# EAGLE design 549-addon (EAGLE 7.2.0)
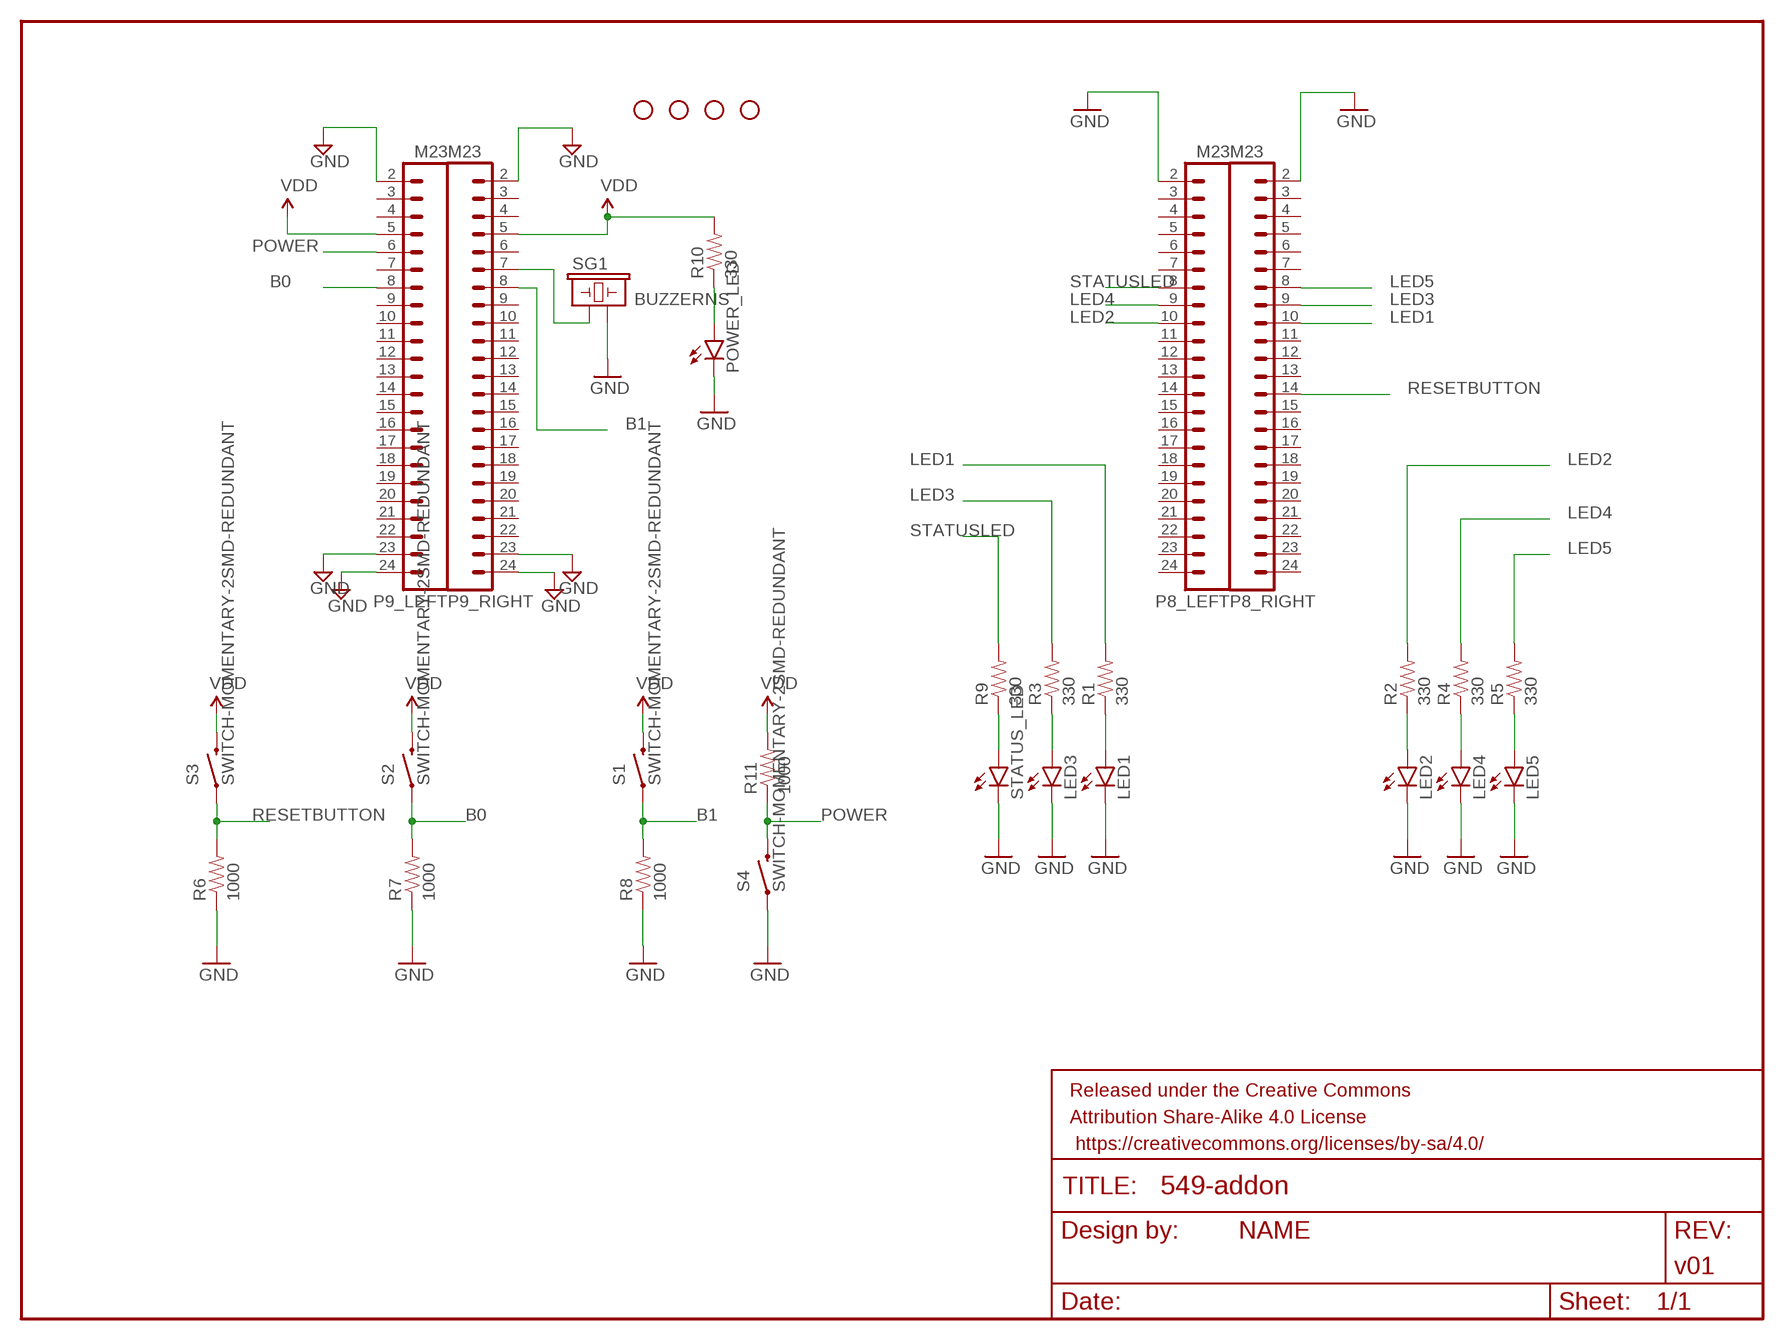
[diagram p0: schematic, sheet 1]

## Parts
FRAME1  FRAME-LETTER  [CREATIVE_COMMONS]
LED1  LED1206  [LED-1206]
LED2  LED1206  [LED-1206]
LED3  LED1206  [LED-1206]
LED4  LED1206  [LED-1206]
LED5  LED1206  [LED-1206]
P8_LEFT  M23  [1X23]
P8_RIGHT  M23  [1X23]
P9_LEFT  M23  [1X23]
P9_RIGHT  M23  [1X23]
POWER_LED  LED1206  [LED-1206]
R1  330  RESISTOR1206  [1206]
R2  330  RESISTOR1206  [1206]
R3  330  RESISTOR1206  [1206]
R4  330  RESISTOR1206  [1206]
R5  330  RESISTOR1206  [1206]
R6  1000  RESISTOR1206  [1206]
R7  1000  RESISTOR1206  [1206]
R8  1000  RESISTOR1206  [1206]
R9  330  RESISTOR1206  [1206]
R10  330  RESISTOR1206  [1206]
R11  1000  RESISTOR1206  [1206]
S1  SWITCH-MOMENTARY-2SMD-REDUNDANT  [TACTILE-SWITCH-SMD]
S2  SWITCH-MOMENTARY-2SMD-REDUNDANT  [TACTILE-SWITCH-SMD]
S3  SWITCH-MOMENTARY-2SMD-REDUNDANT  [TACTILE-SWITCH-SMD]
S4  SWITCH-MOMENTARY-2SMD-REDUNDANT  [TACTILE-SWITCH-SMD]
SG1  BUZZERNS  [BUZZER-12MM-NS]
STANDOFF1  STAND-OFF  [STAND-OFF]
STANDOFF2  STAND-OFF  [STAND-OFF]
STANDOFF3  STAND-OFF  [STAND-OFF]
STANDOFF4  STAND-OFF  [STAND-OFF]
STATUS_LED  LED1206  [LED-1206]

## Nets
B0: P9_LEFT.8 R7.2 S2.1 S2.2
B1: P9_RIGHT.8 R8.2 S1.1 S1.2
GND: LED1.C LED2.C LED3.C LED4.C LED5.C P8_LEFT.2 P8_RIGHT.2 P9_LEFT.2 P9_LEFT.23 P9_LEFT.24 P9_RIGHT.2 P9_RIGHT.23 P9_RIGHT.24 POWER_LED.C R6.1 R7.1 R8.1 S4.1 S4.2 SG1.- STATUS_LED.C
LED1: P8_RIGHT.10 R1.2
LED2: P8_LEFT.10 R2.2
LED3: P8_RIGHT.9 R3.2
LED4: P8_LEFT.9 R4.2
LED5: P8_RIGHT.8 R5.2
N$1: LED1.A R1.1
N$2: LED2.A R2.1
N$3: LED3.A R3.1
N$4: LED4.A R4.1
N$11: LED5.A R5.1
N$12: R9.1 STATUS_LED.A
N$13: POWER_LED.A R10.1
N$14: P9_RIGHT.7 SG1.+
POWER: P9_LEFT.6 R11.1 S4.3 S4.4
RESETBUTTON: P8_RIGHT.14 R6.2 S3.1 S3.2
STATUSLED: P8_LEFT.8 R9.2
VDD: P9_LEFT.5 P9_RIGHT.5 R10.2 R11.2 S1.3 S1.4 S2.3 S2.4 S3.3 S3.4
Unconnected: P8_LEFT.3 P8_LEFT.4 P8_LEFT.5 P8_LEFT.6 P8_LEFT.7 P8_LEFT.11 P8_LEFT.12 P8_LEFT.13 P8_LEFT.14 P8_LEFT.15 P8_LEFT.16 P8_LEFT.17 P8_LEFT.18 P8_LEFT.19 P8_LEFT.20 P8_LEFT.21 P8_LEFT.22 P8_LEFT.23 P8_LEFT.24 P8_RIGHT.3 P8_RIGHT.4 P8_RIGHT.5 P8_RIGHT.6 P8_RIGHT.7 P8_RIGHT.11 P8_RIGHT.12 P8_RIGHT.13 P8_RIGHT.15 P8_RIGHT.16 P8_RIGHT.17 P8_RIGHT.18 P8_RIGHT.19 P8_RIGHT.20 P8_RIGHT.21 P8_RIGHT.22 P8_RIGHT.23 P8_RIGHT.24 P9_LEFT.3 P9_LEFT.4 P9_LEFT.7 P9_LEFT.9 P9_LEFT.10 P9_LEFT.11 P9_LEFT.12 P9_LEFT.13 P9_LEFT.14 P9_LEFT.15 P9_LEFT.16 P9_LEFT.17 P9_LEFT.18 P9_LEFT.19 P9_LEFT.20 P9_LEFT.21 P9_LEFT.22 P9_RIGHT.3 P9_RIGHT.4 P9_RIGHT.6 P9_RIGHT.9 P9_RIGHT.10 P9_RIGHT.11 P9_RIGHT.12 P9_RIGHT.13 P9_RIGHT.14 P9_RIGHT.15 P9_RIGHT.16 P9_RIGHT.17 P9_RIGHT.18 P9_RIGHT.19 P9_RIGHT.20 P9_RIGHT.21 P9_RIGHT.22

## Library data of the parts
FRAME1 = SparkFun-Aesthetics:FRAME-LETTER: Schematic Frame Standard 8.5x11 US Letter frame; DESIGNER: NAME; VERSION: v01
LED1-LED5 POWER_LED STATUS_LED = SparkFun-LED:LED: LEDs Standard schematic elements and footprints for 5mm, 3mm, 1206, and 0603 sized LEDs. 5mm - Spark Fun Electronics SKU : COM-00529 (and others)
P8_LEFT P8_RIGHT P9_LEFT P9_RIGHT = SparkFun-Connectors:M23
R1-R11 = SparkFun-Resistors:RESISTOR: Resistor Basic schematic elements and footprints for 0603, 1206, and PTH resistors.
S1-S4 = SparkFun-Electromechanical:SWITCH-MOMENTARY-2: Various NO switches- pushbuttons, reed, etc; PROD_ID: SWCH-08247
SG1 = SparkFun-Electromechanical:BUZZER: Buzzer 12mm Spark Fun Electronics SKU : Comp-Buzzer
STANDOFF1-STANDOFF4 = SparkFun-Electromechanical:STAND-OFF: #4 Stand Off This is the mechanical footprint for a #4 phillips button head screw. Use the keepout ring to avoid running the screw head into surrounding components. SKU : PRT-00447

## Board
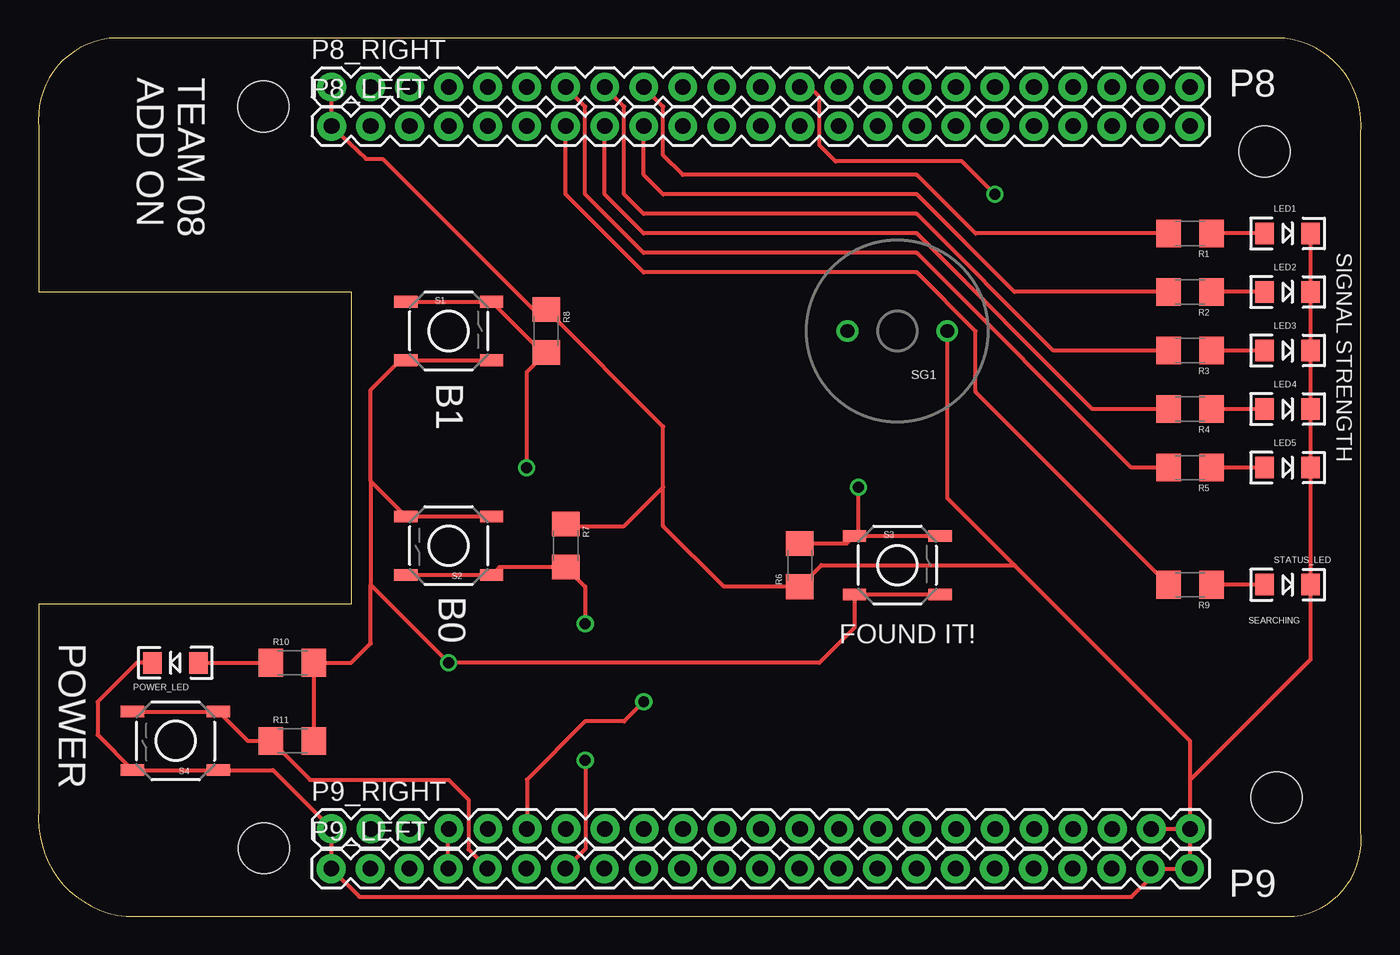
[diagram p1: board, top side]
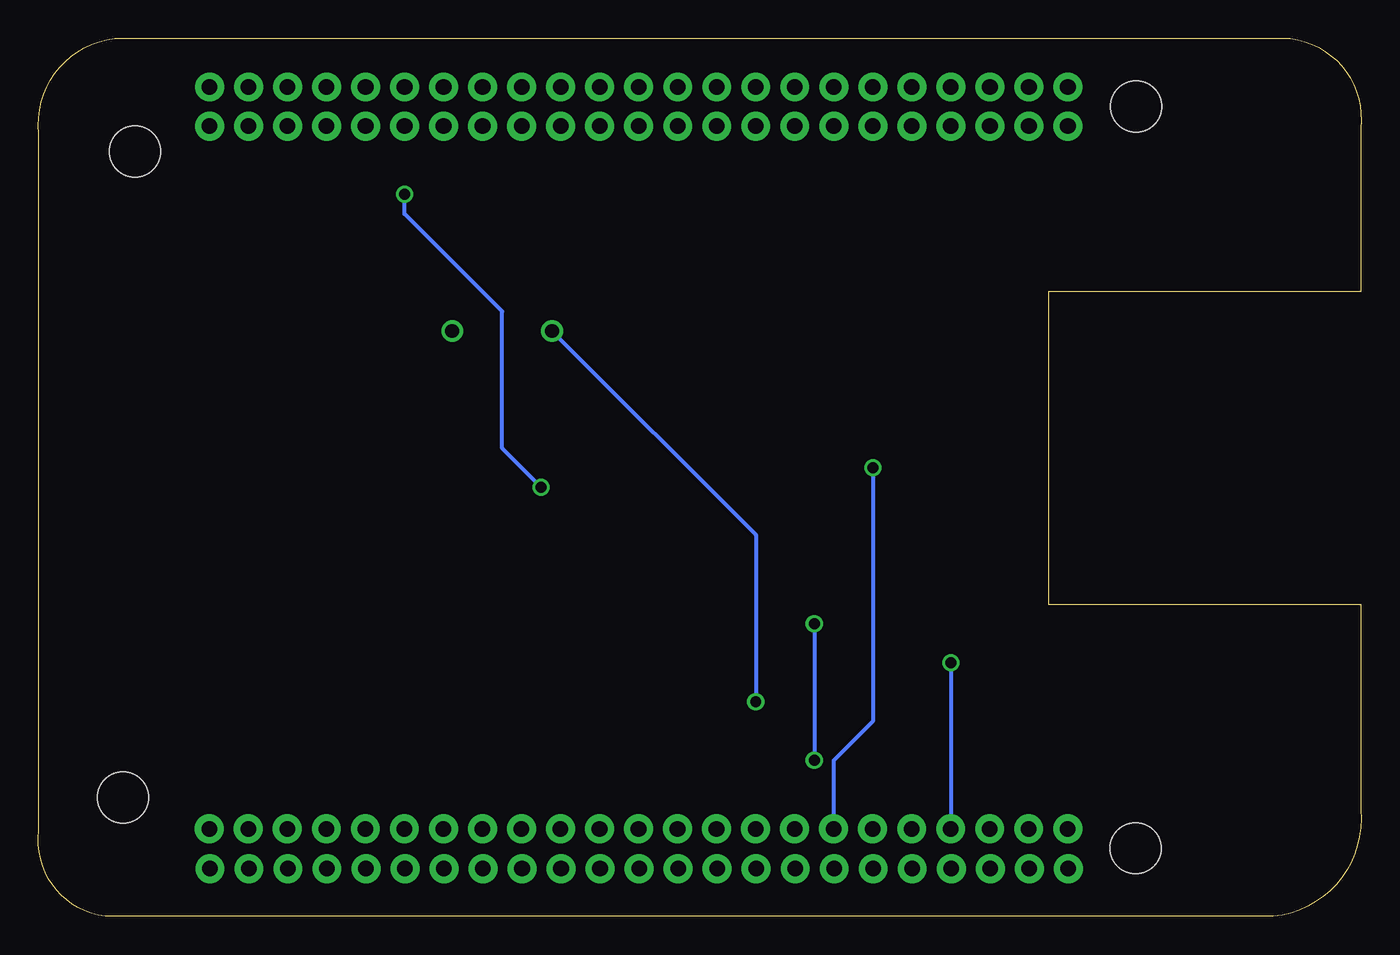
[diagram p2: board, bottom side, seen from below]

Size 86.1 x 57.14 mm. Coordinates in mm from the lower left corner, seen from the top.
Outline: 0.04,20.32 0.04,6.95 arc90 5.72,0 81.76,0 arc90 86.07,5.58 86.07,50.96 arc90 81.15,57.14 4.61,57.14 arc90 0.04,51.3 0.04,40.64 20.36,40.64 20.36,20.32 0.04,20.32
Copper layers (1*16): Top 0.035mm / dielectric 1.5mm / Bottom 0.035mm
Design rules "default": minimum track width 10mil, minimum drill 24mil, track to track 8mil, track to pad 8mil, pad to pad 8mil, via to via 8mil, smd to smd 8mil, copper to edge 40mil, drill to drill 8mil, minimum pad ring 10mil, minimum via ring 8mil, stop-mask expansion 4mil, vias tented up to drill 0mil, thermal gap 10mil

### Footprints (pad centres in the part's own frame; a part is rotated, then mirrored left to right if it is on the bottom)
LED-1206 = smd 1.2 x 1.4: A -1.5,0; C 1.5,0
1X23 = drill 1.016 pad 1.88: 2 -26.67,0; 3 -24.13,0; 4 -21.59,0; 5 -19.05,0; 6 -16.51,0; 7 -13.97,0; 8 -11.43,0; 9 -8.89,0; 10 -6.35,0; 11 -3.81,0; 12 -1.27,0; 13 1.27,0; 14 3.81,0; 15 6.35,0; 16 8.89,0; 17 11.43,0; 18 13.97,0; 19 16.51,0; 20 19.05,0; 21 21.59,0; 22 24.13,0; 23 26.67,0; 24 29.21,0
1206 = smd 1.6 x 1.8: 1 -1.4,0; 2 1.4,0
TACTILE-SWITCH-SMD = smd 1.524 x 0.762: 1 -2.794,1.905; 2 2.794,1.905; 3 -2.794,-1.905; 4 2.794,-1.905
BUZZER-12MM-NS = drill 0.9: + 3.25,0; - -3.25,0
STAND-OFF = hole 3.302: 0,0

### Placement (x,y rotation side)
FRAME1  -77.43,15.24 0 top  (outside the outline)
LED1  81.32,44.45 0 top
LED2  81.32,40.64 0 top
LED3  81.32,36.83 0 top
LED4  81.32,33.02 0 top
LED5  81.32,29.21 0 top
P8_LEFT  45.76,51.44 0 top
P8_RIGHT  45.76,53.98 0 top
P9_LEFT  45.73,3.11 0 top
P9_RIGHT  45.77,5.7 0 top
POWER_LED  8.93,16.51 180 top
R1  74.97,44.45 180 top
R2  74.97,40.64 180 top
R3  74.97,36.83 180 top
R4  74.97,33.02 180 top
R5  74.97,29.21 180 top
R6  49.57,22.86 90 top
R7  34.33,24.13 270 top
R8  33.06,38.1 270 top
R9  74.97,21.59 180 top
R10  16.55,16.51 0 top
R11  16.55,11.43 0 top
S1  26.71,38.1 0 top
S2  26.71,24.13 180 top
S3  55.92,22.86 0 top
S4  8.93,11.43 180 top
SG1  55.92,38.1 180 top
STANDOFF1  14.68,4.45 90 top
STANDOFF2  14.64,52.72 0 top
STANDOFF3  80.61,7.73 0 top
STANDOFF4  79.82,49.78 0 top
STATUS_LED  81.32,21.59 0 top

### Tracks (layer width: path | path; a pad name or v marks a point on that pad's centre or on a via)
B0  (via drill 0.71)
  Top 0.254: S2.2 S2.1 30.01,22.73 R7.2 35.6,21.46 v35.6,19.05 | 34.31,3.11 P9_LEFT.8 34.33,3.11 35.61,4.39 35.61,10.15 v35.6,10.16
  Bottom 0.254: v35.6,19.05 v35.6,10.16
B1  (via drill 0.71)
  Top 0.254: S1.1 S1.2 32.81,36.7 R8.2 31.79,35.43 v31.79,29.21
  Bottom 0.254: v31.79,29.21 31.79,12.7 34.34,10.15 P9_RIGHT.8
GND
  Top 0.254: P9_RIGHT.23 P9_RIGHT.24 | P9_RIGHT.24 74.98,3.11 P9_LEFT.24 P9_LEFT.23 72.4,2.52 71.16,1.27 20.9,1.27 P9_LEFT.2 19.06,5.66 P9_RIGHT.2 15.28,9.53 S4.1 S4.2 3.85,11.81 3.85,13.97 6.39,16.51 POWER_LED.C | P9_RIGHT.24 74.98,8.89 | 74.98,8.89 74.97,8.89 74.97,11.43 63.54,22.86 | LED1.C LED2.C LED3.C LED4.C LED5.C STATUS_LED.C 82.82,16.73 74.98,8.89 | P8_RIGHT.2 P8_LEFT.2 21.32,49.3 22.4,49.3 32.2,39.5 R8.1 40.68,31.88 40.68,27.94 | R7.1 34.46,25.4 38.14,25.4 40.68,27.94 | 63.54,22.86 50.97,22.86 R6.1 44.62,21.46 40.68,25.4 40.68,27.94 | 63.54,22.86 59.17,27.23 SG1.-
LED1
  Top 0.254: R1.2 61,44.45 57.19,48.26 41.95,48.26 40.68,49.53 40.68,52.71 P8_RIGHT.10
LED2
  Top 0.254: R2.2 63.54,40.64 57.19,46.99 40.68,46.99 39.41,48.26 P8_LEFT.10
LED3
  Top 0.254: R3.2 66.08,36.83 57.19,45.72 39.41,45.72 38.14,46.99 38.14,52.71 P8_RIGHT.9
LED4
  Top 0.254: R4.2 68.62,33.02 57.19,44.45 39.41,44.45 36.87,46.99 P8_LEFT.9
LED5
  Top 0.254: R5.2 71.16,29.21 57.19,43.18 39.41,43.18 35.6,46.99 35.6,52.71 P8_RIGHT.8
N$1
  Top 0.254: LED1.A R1.1
N$2
  Top 0.254: LED2.A R2.1
N$3
  Top 0.254: LED3.A R3.1
N$4
  Top 0.254: LED4.A R4.1
N$11
  Top 0.254: LED5.A R5.1
N$12
  Top 0.254: STATUS_LED.A R9.1
N$13
  Top 0.254: POWER_LED.A R10.1
N$14  (via drill 0.71)
  Top 0.254: v39.41,13.97 38.14,12.7 35.6,12.7 31.8,8.9 P9_RIGHT.7
  Bottom 0.254: SG1.+ 39.41,24.84 v39.41,13.97
POWER
  Top 0.254: S4.4 S4.3 13.63,11.43 R11.1 17.69,8.89 26.71,8.89 27.99,7.61 27.99,4.37 29.22,3.14 P9_LEFT.6
RESETBUTTON  (via drill 0.71)
  Top 0.254: S3.1 S3.2 | S3.1 52.62,24.26 R6.2 | S3.1 53.38,25.02 v53.38,27.94 | v62.27,46.99 60.12,49.14 51.89,49.14 50.84,50.19 50.84,53.34 50.2,53.98 P8_RIGHT.14
  Bottom 0.254: v53.38,27.94 55.92,30.48 55.92,39.37 62.27,45.72 v62.27,46.99
STATUSLED
  Top 0.254: R9.2 61,34.16 61,38.1 57.19,41.91 39.41,41.91 34.33,46.99 P8_LEFT.8
VDD  (via drill 0.71)
  Top 0.254: S1.4 S1.3 23.53,36.2 21.63,34.29 21.63,28.32 | S2.3 S2.4 21.63,28.32 | S3.4 S3.3 53.12,18.8 50.84,16.51 v26.71,16.51 21.63,21.59 | P9_LEFT.5 26.68,5.66 P9_RIGHT.5 | 21.63,28.32 21.63,21.59 | R11.2 R10.2 20.36,16.51 21.63,17.78 21.63,21.59
  Bottom 0.254: v26.71,16.51 26.71,5.71 P9_RIGHT.5

### Text on the board
tPlace: TEAM 08 / ADD ON | P8 | SIGNAL STRENGTH | B1 | B0 | SEARCHING | POWER | FOUND IT! | P9